# Altium project lmx2572.PrjPcb
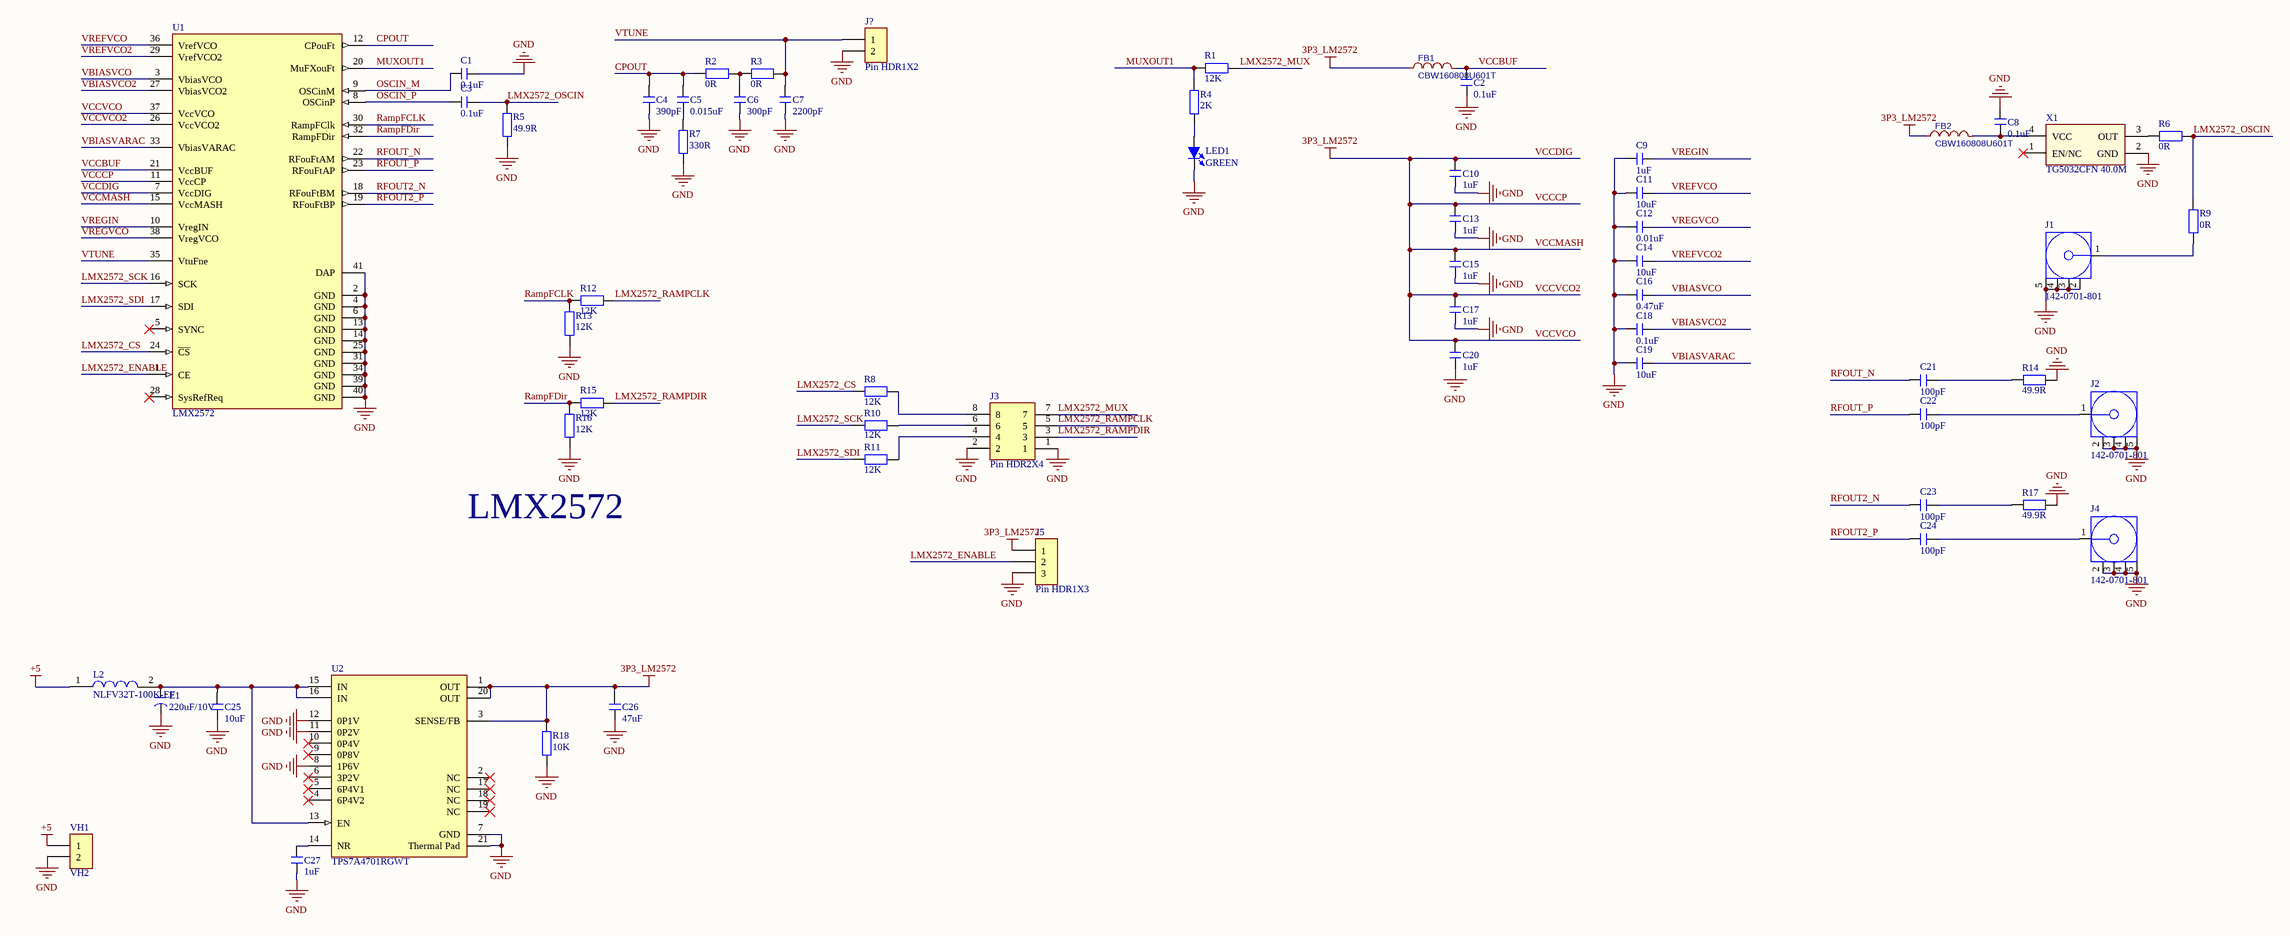
[diagram p0: lmx2572.SchDoc]
1 sheet, 60 parts. Net scope: global (net labels, ports and power ports of the same name join across sheets).
Board file: lmx2572.PcbDoc

## Sheet lmx2572.SchDoc
size A2; SheetNumber: 1; SheetTotal: 1

### Parts
C1  0.1uF  [C 0603_L]
C2  0.1uF  [C 0603_L]
C3  0.1uF  [C 0603_L]
C4  390pF  [C 0603_L]
C5  0.015uF  [C 0603_L]
C6  300pF  [C 0603_L]
C7  2200pF  [C 0603_L]
C8  0.1uF  [C 0603_L]
C9  1uF  [C 0603_L]
C10  1uF  [C 0603_L]
C11  10uF  [C 0603_L]
C12  0.01uF  [C 0603_L]
C13  1uF  [C 0603_L]
C14  10uF  [C 0603_L]
C15  1uF  [C 0603_L]
C16  0.47uF  [C 0603_L]
C17  1uF  [C 0603_L]
C18  0.1uF  [C 0603_L]
C19  10uF  [C 0603_L]
C20  1uF  [C 0603_L]
C21  100pF  [C 0603_L]
C22  100pF  [C 0603_L]
C23  100pF  [C 0603_L]
C24  100pF  [C 0603_L]
C25  10uF  [C 0805_L]
C26  47uF  [C 0805_L]
C27  1uF  [C 0805_L]
E1  220uF/10V  [CD B(3528)]
FB1  CBW160808U601T  [CBW160808U601T]
FB2  CBW160808U601T  [CBW160808U601T]
J1  142-0701-801  [CINC-142-0701-801_V]
J2  142-0701-801  [CINC-142-0701-801_V]
J3  Pin HDR2X4  [Pin HDR2X4/2.54mm-S]
J4  142-0701-801  [CINC-142-0701-801_V]
J5  Pin HDR1X3  [Pin HDR1X3/2.54mm-S]
J?  Pin HDR1X2  [Pin HDR1X2/2.54mm-S]
L2  NLFV32T-100K-EF  [INDPM3225X240N]
LED1  GREEN  [LED 0603G]
R1  12K  [R 0603_L]
R2  0R  [R 0603_L]
R3  0R  [R 0603_L]
R4  2K  [R 0603_L]
R5  49.9R  [R 0603_L]
R6  0R  [R 0603_L]
R7  330R  [R 0603_L]
R8  12K  [R 0603_L]
R9  0R  [R 0603_L]
R10  12K  [R 0603_L]
R11  12K  [R 0603_L]
R12  12K  [R 0603_L]
R13  12K  [R 0603_L]
R14  49.9R  [R 0603_L]
R15  12K  [R 0603_L]
R16  12K  [R 0603_L]
R17  49.9R  [R 0603_L]
R18  10K  [R 0603_L]
U1  LMX2572  [FP-RHA0040H-IPC_C]
U2  TPS7A4701RGWT  [FP-RGW0020A-MFG]
VH1  VH2  [VH3.96-2A]
X1  TG5032CFN 40.0M  [OSC 5032-4P]

### Nets
+5: L2.1 VH1.1
GND: C1.1 C2.1 C4.1 C6.1 C7.1 C8.1 C9.2 C10.1 C11.2 C12.2 C13.1 C14.2 C15.1 C16.2 C17.1 C18.2 C19.2 C20.1 C25.1 C26.1 C27.1 E1.2(K) J1.2 J1.3 J1.4 J1.5 J2.2 J2.3 J2.4 J2.5 J3.1 J3.2 J4.2 J4.3 J4.4 J4.5 J5.3 J?.2 LED1.2(K) R5.1 R7.1 R13.1 R14.2 R16.1 R17.2 R18.1 U1.2(GND) U1.4(GND) U1.6(GND) U1.13(GND) U1.14(GND) U1.25(GND) U1.31(GND) U1.34(GND) U1.39(GND) U1.40(GND) U1.41(DAP) U2.7(GND) U2.8(1P6V) U2.11(0P2V) U2.12(0P1V) U2.21(Thermal_Pad) VH1.2 X1.2(GND)
VCCCP: C10.2 C13.2 C15.2 C17.2 C20.2 C26.2 FB1.1 FB2.1 J5.1 R18.2 U1.7(VccDIG) U1.11(VccCP) U1.15(VccMASH) U1.26(VccVCO2) U1.37(VccVCO) U2.1(OUT) U2.3(SENSE/FB) U2.20(OUT)  [also labelled 3P3_LM2572, VCCDIG, VCCMASH, VCCVCO, VCCVCO2]
CPOUT: C4.2 C5.2 R2.1 U1.12(CPouFt)
LMX2572_CS: R8.1 U1.24(~{CS})
LMX2572_ENABLE: J5.2 U1.1(CE)
LMX2572_MUX: J3.7 R1.2
LMX2572_OSCIN: C3.1 R5.2 R6.2 R9.2
LMX2572_RAMPCLK: J3.5 R12.2
LMX2572_RAMPDIR: J3.3 R15.2
LMX2572_SCK: R10.1 U1.16(SCK)
LMX2572_SDI: R11.1 U1.17(SDI)
MUXOUT1: R1.1 R4.2 U1.20(MuFXouFt)
OSCIN_M: C1.2 U1.9(OSCinM)
OSCIN_P: C3.2 U1.8(OSCinP)
RampFCLK: R12.1 R13.2 U1.30(RampFClk)
RampFDir: R15.1 R16.2 U1.32(RampFDir)
RFOUT2_N: C23.2 U1.18(RFouFtBM)
RFOUT2_P: C24.2 U1.19(RFouFtBP)
RFOUT_N: C21.2 U1.22(RFouFtAM)
RFOUT_P: C22.2 U1.23(RFouFtAP)
VBIASVARAC: C19.1 U1.33(VbiasVARAC)
VBIASVCO: C16.1 U1.3(VbiasVCO)
VBIASVCO2: C18.1 U1.27(VbiasVCO2)
VCCBUF: C2.2 FB1.2 U1.21(VccBUF)
VREFVCO: C11.1 U1.36(VrefVCO)
VREFVCO2: C14.1 U1.29(VrefVCO2)
VREGIN: C9.1 U1.10(VregIN)
VREGVCO: C12.1 U1.38(VregVCO)
VTUNE: C7.2 J?.1 R3.2 U1.35(VtuFne)
NetC5_1: C5.1 R7.2
NetC6_2: C6.2 R2.2 R3.1
NetC8_2: C8.2 FB2.2 X1.4(VCC)
NetC21_1: C21.1 R14.1
NetC22_1: C22.1 J2.1
NetC23_1: C23.1 R17.1
NetC24_1: C24.1 J4.1
NetC25_2: C25.2 E1.1(A) L2.2 U2.13(EN) U2.15(IN) U2.16(IN)
NetC27_2: C27.2 U2.14(NR)
NetJ1_1: J1.1 R9.1
NetJ3_4: J3.4 R11.2
NetJ3_6: J3.6 R10.2
NetJ3_8: J3.8 R8.2
NetLED1_1: LED1.1(A) R4.1
NetR6_1: R6.1 X1.3(OUT)

Not connected (* = marked no-connect by the designer): U1 5(SYNC)* 28(SysRefReq)*; U2 2(NC)* 4(6P4V2)* 5(6P4V1)* 6(3P2V)* 9(0P8V)* 10(0P4V)* 17(NC)* 18(NC)* 19(NC)*; X1 1(EN/NC)*

### Notes on the sheet
- LMX2572
- (in symbol C-CD) +

### Library data of the parts
C1-C27 = C: 无极性贴片电容; 版权归属: 源创客; BOM名称: 无极性贴片电容; 学习资源: www.ooocke.com
E1 = C-CD: 贴片钽电容; 版权归属: 源创客; BOM名称: 贴片钽电容; 学习资源: www.ooocke.com
FB1 FB2 = CBW160808U601T: BOM_Manufacturer: FH; nameAlias: Value; Contributor: LCSC; BOM_Supplier: LCSC; BOM_Manufacturer Part: CBW160808U601T; BOM_Supplier Part: C139183; BOM_JLCPCB Part Class: Extended Part; spicePre: L; spiceSymbolName: CBW160808U601T
J1 J2 J4 = CMP-2000-05490-1: SMA End Launch Jack Receptacle, 50 Ohm, 0 to 18 GHz, -65 to 165 degC, 5-Pin SMD, RoHS, Bulk; Manufacturer: EmersonConnectivitySolutions; Connector Type: JackPCB; Gender: Jack(Female); Impedance: 50Ohms; Brand: Johnson/EmersonConnectivitySolutions; Body Material: Brass; Body Style: Straight; Maximum Frequency: 18GHz; Factory Pack Quantity: 5; Datasheet URL: https://belfuse.com/resources/Johnson/productinformation/pi-142-0701-801.pdf; Datasheet Version: 12/2014; Operating Temperature Range: -65Cto+165C; Mounting Technology: SurfaceMount; RF Series: SMA; Package Reference: 142-0701-801; Product Category: RFConnectors/CoaxialConnectors; Termination Style: Solder; RoHS: Details; Package URL: https://belfuse.com/resources/Johnson/drawings/dr-1420701801.pdf; Series: SMA; Package Description: 5-Pin Surface Mount Device, Body 14.275 x 9.525 mm; Manufacturer URL: http://www.cinch.com/; Contact Plating: Gold; Product: Connectors; Orientation: Straight
L2 = NLFV32T-100K-EF: Inductor; Manufacturer_Name: TDK; Datasheet Link: https://componentsearchengine.com/Datasheets/2/NLFV32T-100K-EF.pdf; Height: 2.4mm; Manufacturer_Part_Number: NLFV32T-100K-EF
LED1 = LED-SMD: 贴片LED; 版权归属: 源创客; BOM名称: 贴片LED; 学习资源: www.ooocke.com
R1-R18 = R: 贴片电阻; 版权归属: 源创客; BOM名称: 贴片电阻; 学习资源: www.ooocke.com
U1 = CMP-04856-000006-1: IC FREQUENCY SYNTH 40VQFN; PLL: Yes; Max Frequency: 2GHz; Input: Clock; Number of Circuits: 1; RoHS Compliant: Yes; Case/Package: VQFN; Mount: Surface Mount; Packaging: Tape and Reel; Max Operating Temperature: 85°C; Min Operating Temperature: -40°C
U2 = CMP-04917-000017-1: IC REG LINEAR POS ADJ 1A 20VQFN; Manufacturer: Texas Instruments; Output Type: AdjustableProgrammable; Dropout Voltage: 307mV; Number Of Outputs: 1; Nominal Supply Current: 0.58-6.1mA; Max Supply Voltage: 35V; Max Junction Temp: +125°C; Standoff Height: 0mm; Accuracy Percentage: 2.5%; Output Voltage: 1.4-34mV; Min Supply Voltage: 3V; Automotive: No; Output Current: 1A; ComponentLink2Description: Datasheet; Octopart: https://octopart.com/tps7a4701rgwt-texas+instruments-30261754; Height: 1mm; Category: IC; Temperature: -40°C to +125°C; Temperature Range High: +125°C; Device Class L1: Integrated Circuits (ICs); Temperature Range Low: -40°C; Device Class L3: Voltage Regulators - Linear; Manufacturer Part Number: TPS7A4701RGWT; Digikey Description: IC REG LINEAR POS ADJ 1A 20VQFN; Device Class L2: Power Management ICs; Lead Free: Yes; Package: RGW0020A; Mouser Description: LDO Voltage Regulators 36V 1A 4.17uVRMS RF LDO VTG Reg; ComponentLink2URL: http://www.ti.com/lit/ds/symlink/tps7a47.pdf; RoHS: TRUE
X1 = XTAL-ACT-4P: 4脚有源晶振; 版权归属: 源创客; BOM名称: 4脚有源晶振; 学习资源: www.ooocke.com